# Altium project Mega2560ProMini-ServosExtendBoard.PrjPCB
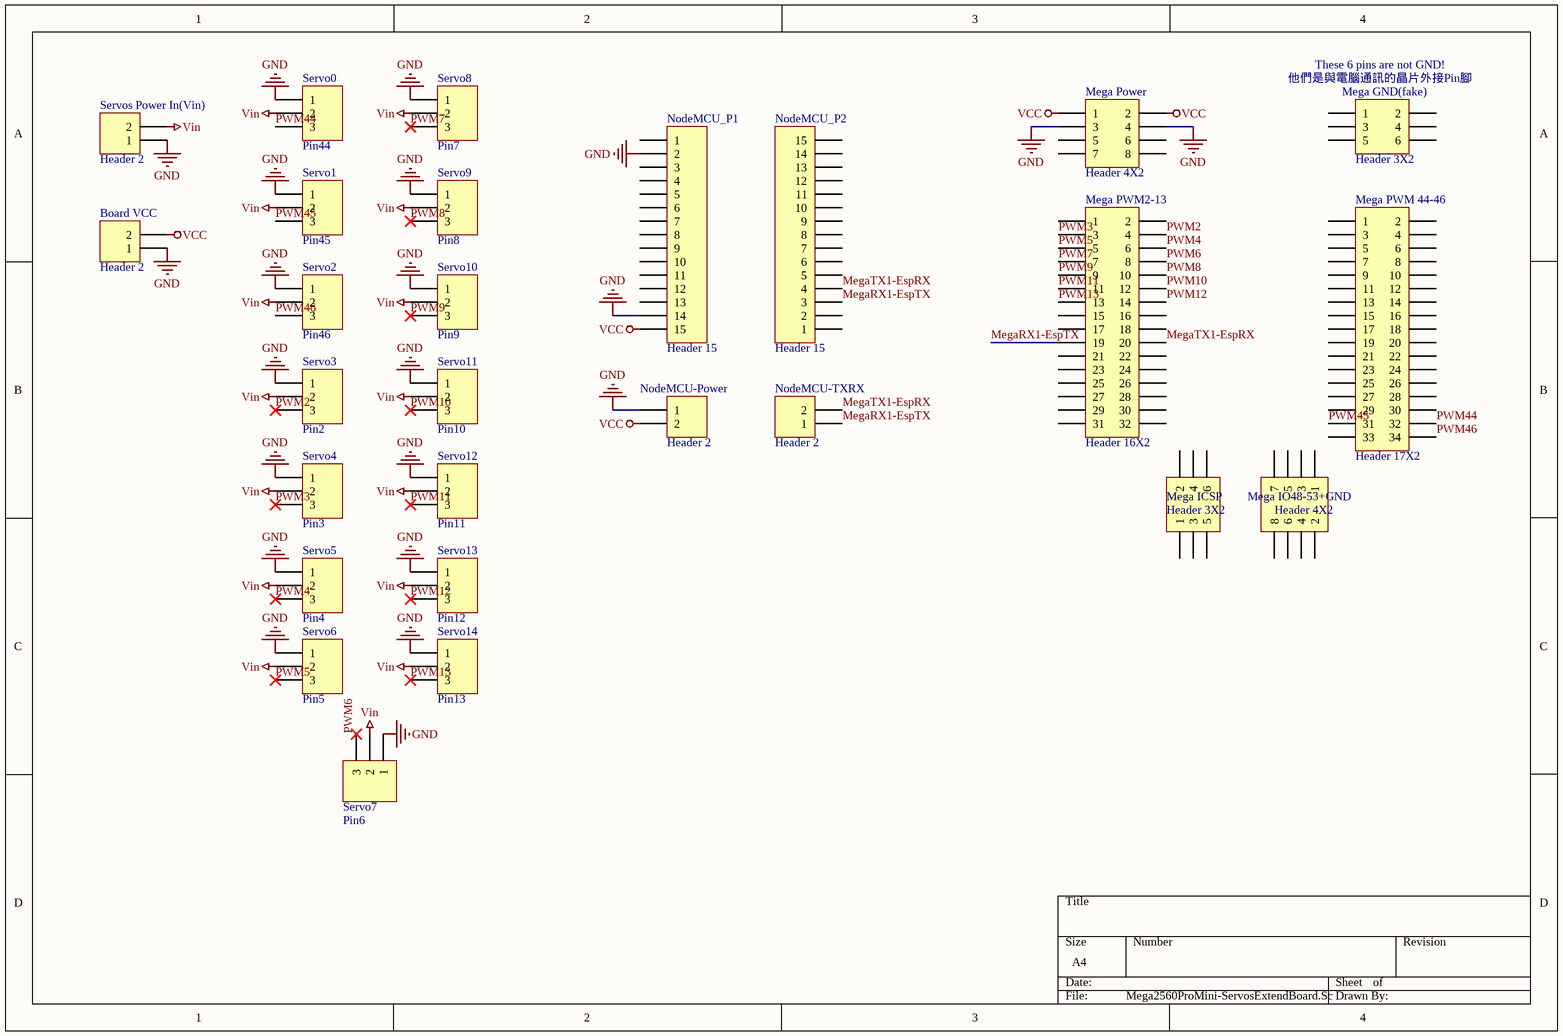
[diagram p0: Mega2560ProMini-ServosExtendBoard.SchDoc]
1 sheet, 27 parts. Net scope: global (net labels, ports and power ports of the same name join across sheets).
Board file: Mega2560ProMini-ServosExtendBoard.PcbDoc

## Sheet Mega2560ProMini-ServosExtendBoard.SchDoc
size A4

### Parts
Board_VCC  Header 2  [HDR1X2]
Mega_GND(fake)  Header 3X2  [HDR2X3]
Mega_ICSP  Header 3X2  [HDR2X3]
Mega_IO48-53+GND  Header 4X2  [HDR2X4]
Mega_Power  Header 4X2  [HDR2X4]
Mega_PWM2-13  Header 16X2  [HDR2X16]
Mega_PWM_44-46  Header 17X2  [HDR2X17]
NodeMCU-Power  Header 2  [HDR1X2]
NodeMCU-TXRX  Header 2  [HDR1X2]
NodeMCU_P1  Header 15  [HDR1X15]
NodeMCU_P2  Header 15  [HDR1X15]
Servo0  Pin44  [HDR1X3]
Servo1  Pin45  [HDR1X3]
Servo2  Pin46  [HDR1X3]
Servo3  Pin2  [HDR1X3]
Servo4  Pin3  [HDR1X3]
Servo5  Pin4  [HDR1X3]
Servo6  Pin5  [HDR1X3]
Servo7  Pin6  [HDR1X3]
Servo8  Pin7  [HDR1X3]
Servo9  Pin8  [HDR1X3]
Servo10  Pin9  [HDR1X3]
Servo11  Pin10  [HDR1X3]
Servo12  Pin11  [HDR1X3]
Servo13  Pin12  [HDR1X3]
Servo14  Pin13  [HDR1X3]
Servos_Power_In(Vin)  Header 2  [HDR1X2]

### Nets
GND: Board_VCC.1 Mega_Power.3 Mega_Power.4 NodeMCU-Power.1 NodeMCU_P1.2 NodeMCU_P1.14 Servo0.1 Servo1.1 Servo2.1 Servo3.1 Servo4.1 Servo5.1 Servo6.1 Servo7.1 Servo8.1 Servo9.1 Servo10.1 Servo11.1 Servo12.1 Servo13.1 Servo14.1 Servos_Power_In(Vin).1
VCC: Board_VCC.2 Mega_Power.1 Mega_Power.2 NodeMCU-Power.2 NodeMCU_P1.15
Vin: Servo0.2 Servo1.2 Servo2.2 Servo3.2 Servo4.2 Servo5.2 Servo6.2 Servo7.2 Servo8.2 Servo9.2 Servo10.2 Servo11.2 Servo12.2 Servo13.2 Servo14.2 Servos_Power_In(Vin).2
MegaRX1-EspTX: Mega_PWM2-13.19 NodeMCU-TXRX.1 NodeMCU_P2.3
MegaTX1-EspRX: Mega_PWM2-13.20 NodeMCU-TXRX.2 NodeMCU_P2.4
PWM2: Mega_PWM2-13.4 Servo3.3
PWM3: Mega_PWM2-13.3 Servo4.3
PWM4: Mega_PWM2-13.6 Servo5.3
PWM5: Mega_PWM2-13.5 Servo6.3
PWM6: Mega_PWM2-13.8 Servo7.3
PWM7: Mega_PWM2-13.7 Servo8.3
PWM8: Mega_PWM2-13.10 Servo9.3
PWM9: Mega_PWM2-13.9 Servo10.3
PWM10: Mega_PWM2-13.12 Servo11.3
PWM11: Mega_PWM2-13.11 Servo12.3
PWM12: Mega_PWM2-13.14 Servo13.3
PWM13: Mega_PWM2-13.13 Servo14.3
PWM44: Mega_PWM_44-46.32 Servo0.3
PWM45: Mega_PWM_44-46.31 Servo1.3
PWM46: Mega_PWM_44-46.34 Servo2.3

Not connected (* = marked no-connect by the designer): Mega_GND(fake) 1 2 3 4 5 6; Mega_ICSP 1 2 3 4 5 6; Mega_IO48-53+GND 1 2 3 4 5 6 7 8; Mega_Power 5 6 7 8; Mega_PWM2-13 1 2 15 16 17 18 21 22 23 24 25 26 27 28 29 30 31 32; Mega_PWM_44-46 1 2 3 4 5 6 7 8 9 10 11 12 13 14 15 16 17 18 19 20 21 22 23 24 25 26 27 28 29 30 33; NodeMCU_P1 1 3 4 5 6 7 8 9 10 11 12 13; NodeMCU_P2 1 2 5 6 7 8 9 10 11 12 13 14 15

### Notes on the sheet
- (near Mega_GND(fake)) 他們是與電腦通訊的晶片外接Pin腳
- (near Mega_GND(fake)) These 6 pins are not GND!

### Library data of the parts
Board_VCC NodeMCU-Power NodeMCU-TXRX Servos_Power_In(Vin) = Header 2: Header, 2-Pin; LatestRevisionDate: 17-Jul-2002; LatestRevisionNote: Re-released for DXP Platform.; Publisher: Altium Limited
Mega_GND(fake) Mega_ICSP = Header 3X2: Header, 3-Pin, Dual row; LatestRevisionDate: 17-Jul-2002; LatestRevisionNote: Re-released for DXP Platform.; Publisher: Altium Limited
Mega_IO48-53+GND Mega_Power = Header 4X2: Header, 4-Pin, Dual row; LatestRevisionDate: 17-Jul-2002; LatestRevisionNote: Re-released for DXP Platform.; Publisher: Altium Limited
Mega_PWM2-13 = Header 16X2: Header, 16-Pin, Dual row; LatestRevisionDate: 17-Jul-2002; LatestRevisionNote: Re-released for DXP Platform.; Publisher: Altium Limited
Mega_PWM_44-46 = Header 17X2: Header, 17-Pin, Dual row; LatestRevisionDate: 17-Jul-2002; LatestRevisionNote: Re-released for DXP Platform.; Publisher: Altium Limited
NodeMCU_P1 NodeMCU_P2 = Header 15: Header, 15-Pin; LatestRevisionDate: 17-Jul-2002; LatestRevisionNote: Re-released for DXP Platform.; Publisher: Altium Limited
Servo0-Servo14 = Header 3: Header, 3-Pin; LatestRevisionDate: 17-Jul-2002; LatestRevisionNote: Re-released for DXP Platform.; Publisher: Altium Limited